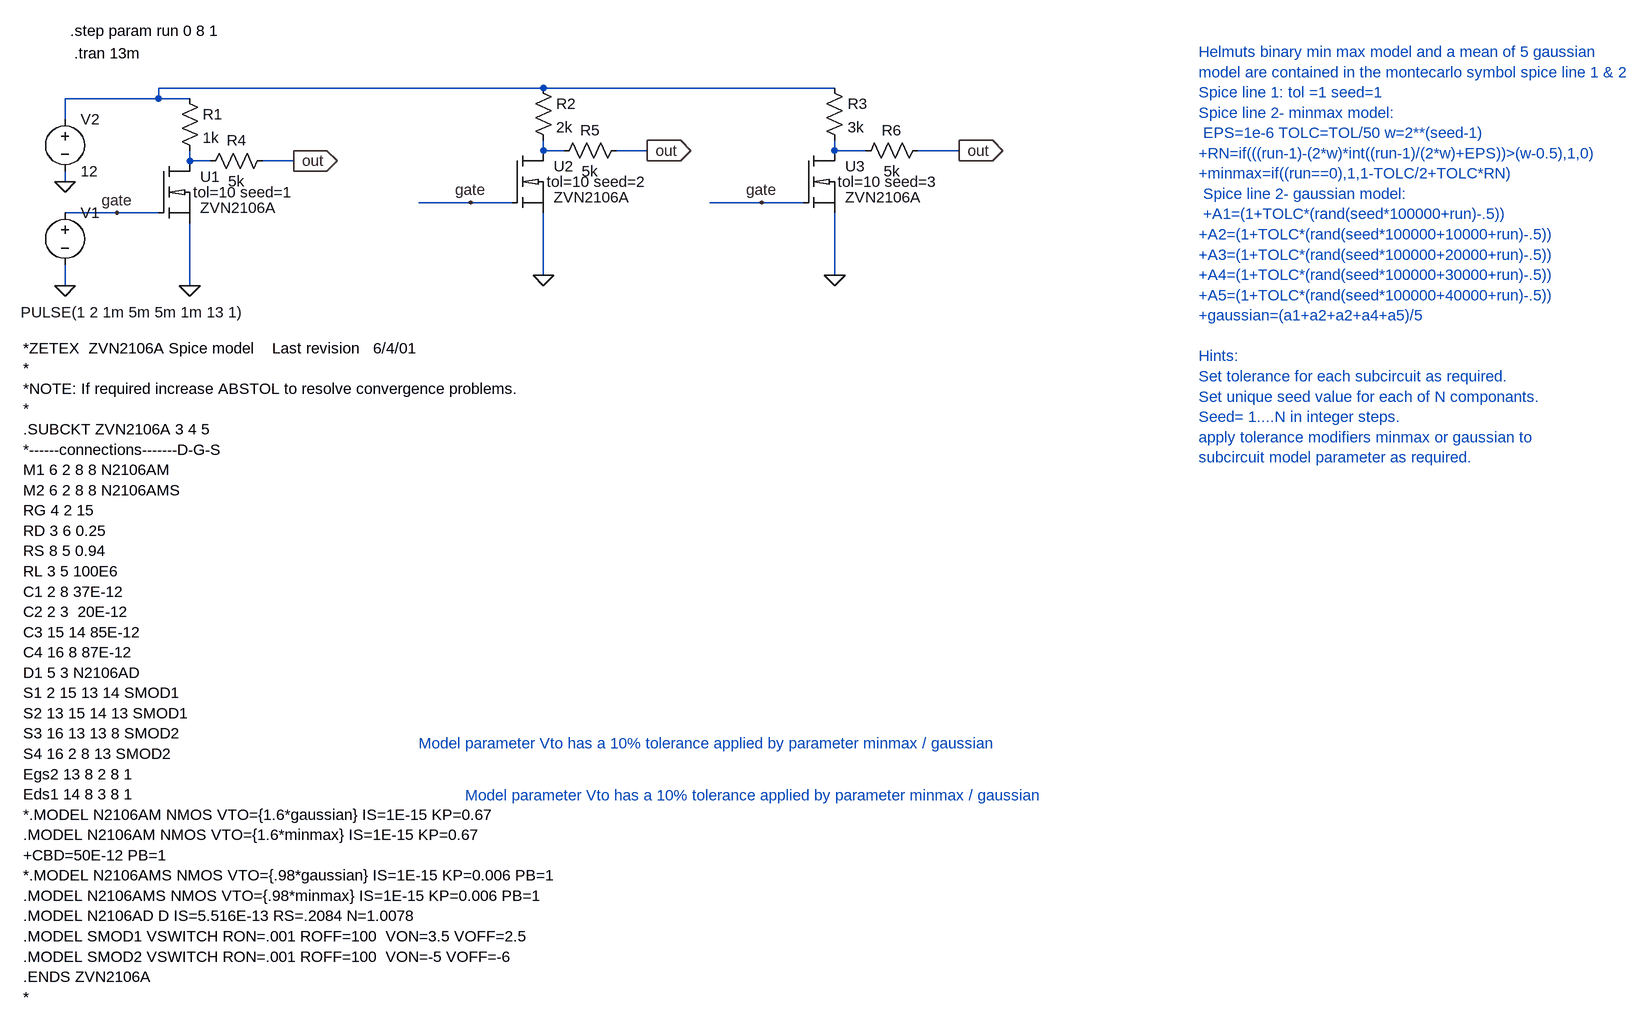
[diagram p0: schematic motecarlo_mosfet_multiple.asc]
motecarlo_mosfet_multiple.asc, the LTspice schematic file:
Version 4
SHEET 1 2376 1624
WIRE -64 80 -64 48
WIRE -64 176 -64 160
WIRE -64 336 -64 304
WIRE 16 224 -64 224
WIRE 80 48 -64 48
WIRE 80 48 80 32
WIRE 80 224 16 224
WIRE 128 48 80 48
WIRE 128 144 128 128
WIRE 128 336 128 240
WIRE 160 144 128 144
WIRE 288 144 240 144
WIRE 560 208 480 208
WIRE 624 208 560 208
WIRE 672 32 80 32
WIRE 672 128 672 112
WIRE 672 320 672 224
WIRE 704 128 672 128
WIRE 832 128 784 128
WIRE 1008 208 928 208
WIRE 1072 208 1008 208
WIRE 1120 32 672 32
WIRE 1120 128 1120 112
WIRE 1120 320 1120 224
WIRE 1168 128 1120 128
WIRE 1312 128 1248 128
FLAG 128 336 0
FLAG -64 336 0
FLAG -64 176 0
FLAG 288 144 out
IOPIN 288 144 Out
FLAG 16 224 gate
FLAG 672 320 0
FLAG 832 128 out
IOPIN 832 128 Out
FLAG 560 208 gate
FLAG 1120 320 0
FLAG 1312 128 out
IOPIN 1312 128 Out
FLAG 1008 208 gate
SYMBOL voltage -64 208 R0
WINDOW 3 -68 169 Left 0
WINDOW 123 0 0 Left 0
WINDOW 39 0 0 Left 0
SYMATTR Value PULSE(1 2 1m 5m 5m 1m 13 1)
SYMATTR InstName V1
SYMBOL Sources\\voltage -64 64 R0
WINDOW 123 0 0 Left 0
WINDOW 39 0 0 Left 0
SYMATTR InstName V2
SYMATTR Value 12
SYMBOL res 112 32 R0
SYMATTR InstName R1
SYMATTR Value 1k
SYMBOL xnmos_mc 80 144 R0
SYMATTR InstName U1
SYMATTR SpiceModel ZVN2106A
SYMATTR SpiceLine tol=10 seed=1
SYMBOL res 656 16 R0
SYMATTR InstName R2
SYMATTR Value 2k
SYMBOL xnmos_mc 624 128 R0
SYMATTR InstName U2
SYMATTR SpiceModel ZVN2106A
SYMATTR SpiceLine tol=10 seed=2
SYMBOL res 1104 16 R0
SYMATTR InstName R3
SYMATTR Value 3k
SYMBOL xnmos_mc 1072 128 R0
SYMATTR InstName U3
SYMATTR SpiceModel ZVN2106A
SYMATTR SpiceLine tol=10 seed=3
SYMBOL res 256 128 R90
WINDOW 0 0 56 VBottom 0
WINDOW 3 32 56 VTop 0
SYMATTR InstName R4
SYMATTR Value 5k
SYMBOL res 800 112 R90
WINDOW 0 0 56 VBottom 0
WINDOW 3 32 56 VTop 0
SYMATTR InstName R5
SYMATTR Value 5k
SYMBOL res 1264 112 R90
WINDOW 0 0 56 VBottom 0
WINDOW 3 32 56 VTop 0
SYMATTR InstName R6
SYMATTR Value 5k
TEXT -50 -22 Left 0 !.tran 13m
TEXT -56 -56 Left 0 !.step param run 0 8 1
TEXT 1680 -24 Left 0 ;Helmuts binary min max model and a mean of 5 gaussian \nmodel are contained in the montecarlo symbol spice line 1 & 2\nSpice line 1: tol =1 seed=1\nSpice line 2- minmax model:\n EPS=1e-6 TOLC=TOL/50 w=2**(seed-1)\n+RN=if(((run-1)-(2*w)*int((run-1)/(2*w)+EPS))>(w-0.5),1,0)\n+minmax=if((run==0),1,1-TOLC/2+TOLC*RN)\n Spice line 2- gaussian model: \n +A1=(1+TOLC*(rand(seed*100000+run)-.5)) \n+A2=(1+TOLC*(rand(seed*100000+10000+run)-.5)) \n+A3=(1+TOLC*(rand(seed*100000+20000+run)-.5)) \n+A4=(1+TOLC*(rand(seed*100000+30000+run)-.5)) \n+A5=(1+TOLC*(rand(seed*100000+40000+run)-.5)) \n+gaussian=(a1+a2+a2+a4+a5)/5\n \nHints:\nSet tolerance for each subcircuit as required.\nSet unique seed value for each of N componants.\nSeed= 1....N in integer steps.\napply tolerance modifiers minmax or gaussian to\nsubcircuit model parameter as required.
TEXT -128 432 Left 0 !*ZETEX  ZVN2106A Spice model    Last revision   6/4/01\n*\n*NOTE: If required increase ABSTOL to resolve convergence problems.\n*\n.SUBCKT ZVN2106A 3 4 5\n*------connections-------D-G-S\nM1 6 2 8 8 N2106AM\nM2 6 2 8 8 N2106AMS\nRG 4 2 15\nRD 3 6 0.25\nRS 8 5 0.94 \nRL 3 5 100E6\nC1 2 8 37E-12\nC2 2 3  20E-12\nC3 15 14 85E-12 \nC4 16 8 87E-12\nD1 5 3 N2106AD\nS1 2 15 13 14 SMOD1\nS2 13 15 14 13 SMOD1\nS3 16 13 13 8 SMOD2\nS4 16 2 8 13 SMOD2\nEgs2 13 8 2 8 1\nEds1 14 8 3 8 1\n*.MODEL N2106AM NMOS VTO={1.6*gaussian} IS=1E-15 KP=0.67\n.MODEL N2106AM NMOS VTO={1.6*minmax} IS=1E-15 KP=0.67\n+CBD=50E-12 PB=1\n*.MODEL N2106AMS NMOS VTO={.98*gaussian} IS=1E-15 KP=0.006 PB=1\n.MODEL N2106AMS NMOS VTO={.98*minmax} IS=1E-15 KP=0.006 PB=1\n.MODEL N2106AD D IS=5.516E-13 RS=.2084 N=1.0078\n.MODEL SMOD1 VSWITCH RON=.001 ROFF=100  VON=3.5 VOFF=2.5\n.MODEL SMOD2 VSWITCH RON=.001 ROFF=100  VON=-5 VOFF=-6\n.ENDS ZVN2106A\n*
TEXT 480 1040 Left 0 ;Model parameter Vto has a 10% tolerance applied by parameter minmax / gaussian
TEXT 552 1120 Left 0 ;Model parameter Vto has a 10% tolerance applied by parameter minmax / gaussian

The netlist it stands for:
* motecarlo_mosfet_multiple.asc
V1 gate 0 PULSE(1 2 1m 5m 5m 1m 13 1)
V2 N001 0 12
R1 N001 N002 1k
XU1 N002 gate 0 ZVN2106A tol=10 seed=1 EPS=1.0e-6 TOLC=TOL/50  w=2**(seed-1)  RN=if(((run-1)-(2*w)*int((run-1)/(2*w)+EPS))>(w-0.5),1,0)  minmax=(if((run==0),1,1-TOLC/2+TOLC*RN)) A1=(1+TOLC*(rand(seed*100000+run)-.5)) A2=(1+TOLC*(rand(seed*100000+10000+run)-.5)) A3=(1+TOLC*(rand(seed*100000+20000+run)-.5)) A4=(1+TOLC*(rand(seed*100000+30000+run)-.5)) A5=(1+TOLC*(rand(seed*100000+40000+run)-.5)) gaussian=(a1+a2+a2+a4+a5)/5  ; pins D G S
R2 N001 N003 2k
XU2 N003 gate 0 ZVN2106A tol=10 seed=2 EPS=1.0e-6 TOLC=TOL/50  w=2**(seed-1)  RN=if(((run-1)-(2*w)*int((run-1)/(2*w)+EPS))>(w-0.5),1,0)  minmax=(if((run==0),1,1-TOLC/2+TOLC*RN)) A1=(1+TOLC*(rand(seed*100000+run)-.5)) A2=(1+TOLC*(rand(seed*100000+10000+run)-.5)) A3=(1+TOLC*(rand(seed*100000+20000+run)-.5)) A4=(1+TOLC*(rand(seed*100000+30000+run)-.5)) A5=(1+TOLC*(rand(seed*100000+40000+run)-.5)) gaussian=(a1+a2+a2+a4+a5)/5  ; pins D G S
R3 N001 N004 3k
XU3 N004 gate 0 ZVN2106A tol=10 seed=3 EPS=1.0e-6 TOLC=TOL/50  w=2**(seed-1)  RN=if(((run-1)-(2*w)*int((run-1)/(2*w)+EPS))>(w-0.5),1,0)  minmax=(if((run==0),1,1-TOLC/2+TOLC*RN)) A1=(1+TOLC*(rand(seed*100000+run)-.5)) A2=(1+TOLC*(rand(seed*100000+10000+run)-.5)) A3=(1+TOLC*(rand(seed*100000+20000+run)-.5)) A4=(1+TOLC*(rand(seed*100000+30000+run)-.5)) A5=(1+TOLC*(rand(seed*100000+40000+run)-.5)) gaussian=(a1+a2+a2+a4+a5)/5  ; pins D G S
R4 out N002 5k
R5 out N003 5k
R6 out N004 5k
.tran 13m
.step param run 0 8 1
* Helmuts binary min max model and a mean of 5 gaussian
* model are contained in the montecarlo symbol spice line 1 & 2
* Spice line 1: tol =1 seed=1
* Spice line 2- minmax model:
*  EPS=1e-6 TOLC=TOL/50 w=2**(seed-1)
* +RN=if(((run-1)-(2*w)*int((run-1)/(2*w)+EPS))>(w-0.5),1,0)
* +minmax=if((run==0),1,1-TOLC/2+TOLC*RN)
*  Spice line 2- gaussian model:
*  +A1=(1+TOLC*(rand(seed*100000+run)-.5))
* +A2=(1+TOLC*(rand(seed*100000+10000+run)-.5))
* +A3=(1+TOLC*(rand(seed*100000+20000+run)-.5))
* +A4=(1+TOLC*(rand(seed*100000+30000+run)-.5))
* +A5=(1+TOLC*(rand(seed*100000+40000+run)-.5))
* +gaussian=(a1+a2+a2+a4+a5)/5
* Hints:
* Set tolerance for each subcircuit as required.
* Set unique seed value for each of N componants.
* Seed= 1....N in integer steps.
* apply tolerance modifiers minmax or gaussian to
* subcircuit model parameter as required.
*ZETEX  ZVN2106A Spice model    Last revision   6/4/01
*
*NOTE: If required increase ABSTOL to resolve convergence problems.
*
.SUBCKT ZVN2106A 3 4 5
*------connections-------D-G-S
M1 6 2 8 8 N2106AM
M2 6 2 8 8 N2106AMS
RG 4 2 15
RD 3 6 0.25
RS 8 5 0.94
RL 3 5 100E6
C1 2 8 37E-12
C2 2 3  20E-12
C3 15 14 85E-12
C4 16 8 87E-12
D1 5 3 N2106AD
S1 2 15 13 14 SMOD1
S2 13 15 14 13 SMOD1
S3 16 13 13 8 SMOD2
S4 16 2 8 13 SMOD2
Egs2 13 8 2 8 1
Eds1 14 8 3 8 1
*.MODEL N2106AM NMOS VTO={1.6*gaussian} IS=1E-15 KP=0.67
.MODEL N2106AM NMOS VTO={1.6*minmax} IS=1E-15 KP=0.67
+CBD=50E-12 PB=1
*.MODEL N2106AMS NMOS VTO={.98*gaussian} IS=1E-15 KP=0.006 PB=1
.MODEL N2106AMS NMOS VTO={.98*minmax} IS=1E-15 KP=0.006 PB=1
.MODEL N2106AD D IS=5.516E-13 RS=.2084 N=1.0078
.MODEL SMOD1 VSWITCH RON=.001 ROFF=100  VON=3.5 VOFF=2.5
.MODEL SMOD2 VSWITCH RON=.001 ROFF=100  VON=-5 VOFF=-6
.ENDS ZVN2106A
*
* Model parameter Vto has a 10% tolerance applied by parameter minmax / gaussian
* Model parameter Vto has a 10% tolerance applied by parameter minmax / gaussian
.backanno
.end